# Altium schematic sheet Nucleo.SchDoc
size A4; Organization: BME AUT; Address1: Magyar tudósok krt. 2.; Address2: Q épület; Address3: Budapest; Address4: H-1117; DocumentNumber: 1; SheetNumber: 1; SheetTotal: 2
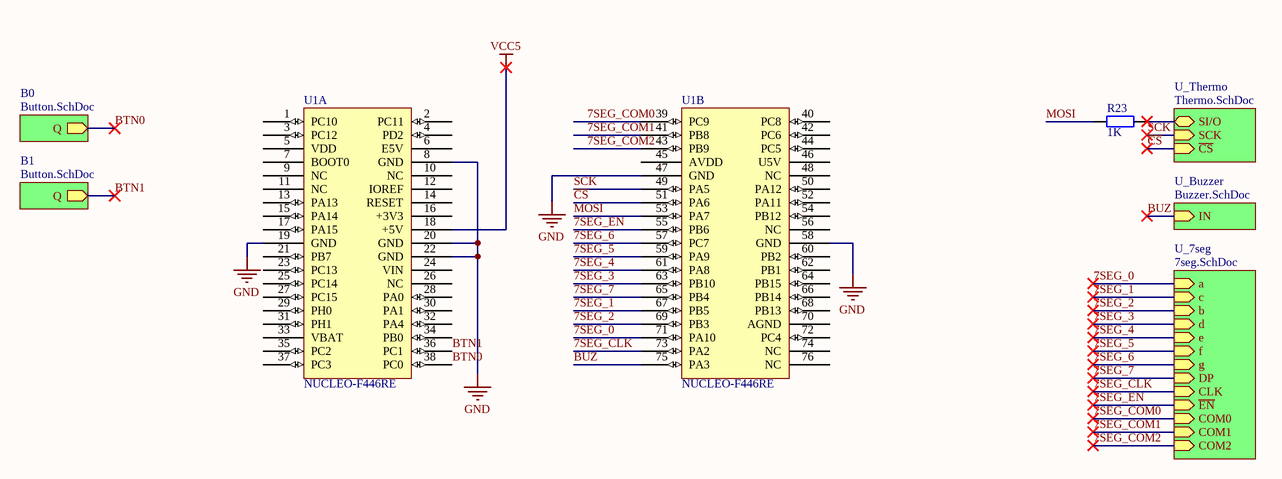
[diagram p0: Nucleo.SchDoc]

## Parts
R23  1K  [FP_0805_RES]
U1  NUCLEO-F446RE  [FP_NUCLEO-64]  (parts A,B of 2)

## Sub-sheets
B0 = Button.SchDoc: Q (out)
B1 = Button.SchDoc: Q (out)
U_7seg = 7seg.SchDoc: a (in), c (in), b (in), d (in), e (in), f (in), g (in), DP (in), CLK (in), ~{EN} (in), COM0 (in), COM1 (in), COM2 (in)
U_Buzzer = Buzzer.SchDoc: IN (in)
U_Thermo = Thermo.SchDoc: SI/O (bidir), SCK (in), ~{CS} (in)

## Nets
GND: U1.8(GND) U1.19(GND) U1.20(GND) U1.22(GND) U1.47(GND) U1.58(GND)
VCC5: U1.18(+5V)
7SEG_0: U1.71(PA10) ; sheet U_7seg/a
7SEG_1: U1.67(PB5) ; sheet U_7seg/c
7SEG_2: U1.69(PB3) ; sheet U_7seg/b
7SEG_3: U1.63(PB10) ; sheet U_7seg/d
7SEG_4: U1.61(PA8) ; sheet U_7seg/e
7SEG_5: U1.59(PA9) ; sheet U_7seg/f
7SEG_6: U1.57(PC7) ; sheet U_7seg/g
7SEG_7: U1.65(PB4) ; sheet U_7seg/DP
7SEG_CLK: U1.73(PA2) ; sheet U_7seg/CLK
7SEG_COM0: U1.39(PC9) ; sheet U_7seg/COM0
7SEG_COM1: U1.41(PB8) ; sheet U_7seg/COM1
7SEG_COM2: U1.43(PB9) ; sheet U_7seg/COM2
7SEG_EN: U1.55(PB6) ; sheet U_7seg/~{EN}
BTN0: U1.38(PC0) ; sheet B0/Q
BTN1: U1.36(PC1) ; sheet B1/Q
BUZ: U1.75(PA3) ; sheet U_Buzzer/IN
~{CS}: U1.51(PA6) ; sheet U_Thermo/~{CS}
MOSI: R23.1 U1.53(PA7)
SCK: U1.49(PA5) ; sheet U_Thermo/SCK
NetR23_2: R23.2 ; sheet U_Thermo/SI/O

Not connected (* = marked no-connect by the designer): U1 1(PC10) 2(PC11) 3(PC12) 4(PD2) 5(VDD) 6(E5V) 7(BOOT0) 9(NC) 10(NC) 11(NC) 12(IOREF) 13(PA13) 14(RESET) 15(PA14) 16(+3V3) 17(PA15) 21(PB7) 23(PC13) 24(VIN) 25(PC14) 26(NC) 27(PC15) 28(PA0) 29(PH0) 30(PA1) 31(PH1) 32(PA4) 33(VBAT) 34(PB0) 35(PC2) 37(PC3) 40(PC8) 42(PC6) 44(PC5) 45(AVDD) 46(U5V) 48(NC) 50(PA12) 52(PA11) 54(PB12) 56(NC) 60(PB2) 62(PB1) 64(PB15) 66(PB14) 68(PB13) 70(AGND) 72(PC4) 74(NC) 76(NC)

## Notes on the sheet
- Title
- Size:
- Date:
- A4
- Number:
- Time:
- Revision:
- Sheet
- of
- File:

## Library data of the parts
R23 = RES 1K: Resistor; Tolerance: 5%; Power: 125mW; Name: YAGEO (PHYCOMP)  RC0805JR-071KL  SMD Chip Resistor, Thick Film, 1 kohm; Reference: 9234004; Supplier: Farnell; Value: 1K
U1 = NUCLEO-F446RE: Reference: NUCLEO; Name: Nucleo F446RE; Supplier: Tanszék